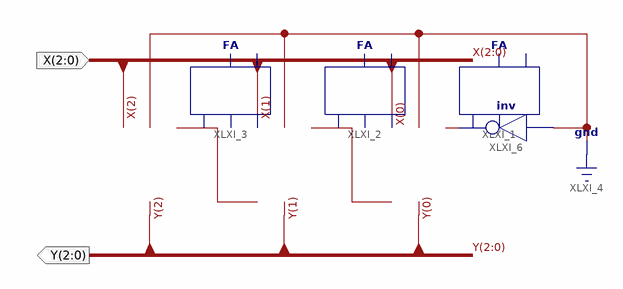
[diagram p0: schematic sheet 1]
// Xilinx ISE schematic Adder_3bit.sch (spartan3e) as structural Verilog: 4 symbols, 2 ports
module Adder_3bit (
  input  [2:0] X,
  output [2:0] Y
);

  wire XLXN_12, XLXN_13, XLXN_20;

  FA XLXI_1 (.A(X[0]), .B(1'b0), .C_in(XLXN_20), .C_out(XLXN_12), .S(Y[0]));
  FA XLXI_2 (.A(X[1]), .B(1'b0), .C_in(XLXN_12), .C_out(XLXN_13), .S(Y[1]));
  FA XLXI_3 (.A(X[2]), .B(1'b0), .C_in(XLXN_13), .S(Y[2]));  // open: C_out
  not XLXI_6 (XLXN_20, 1'b0);
endmodule
